# EAGLE schematic PPU_LITE_LATT_V3 (EAGLE 9.6.2)
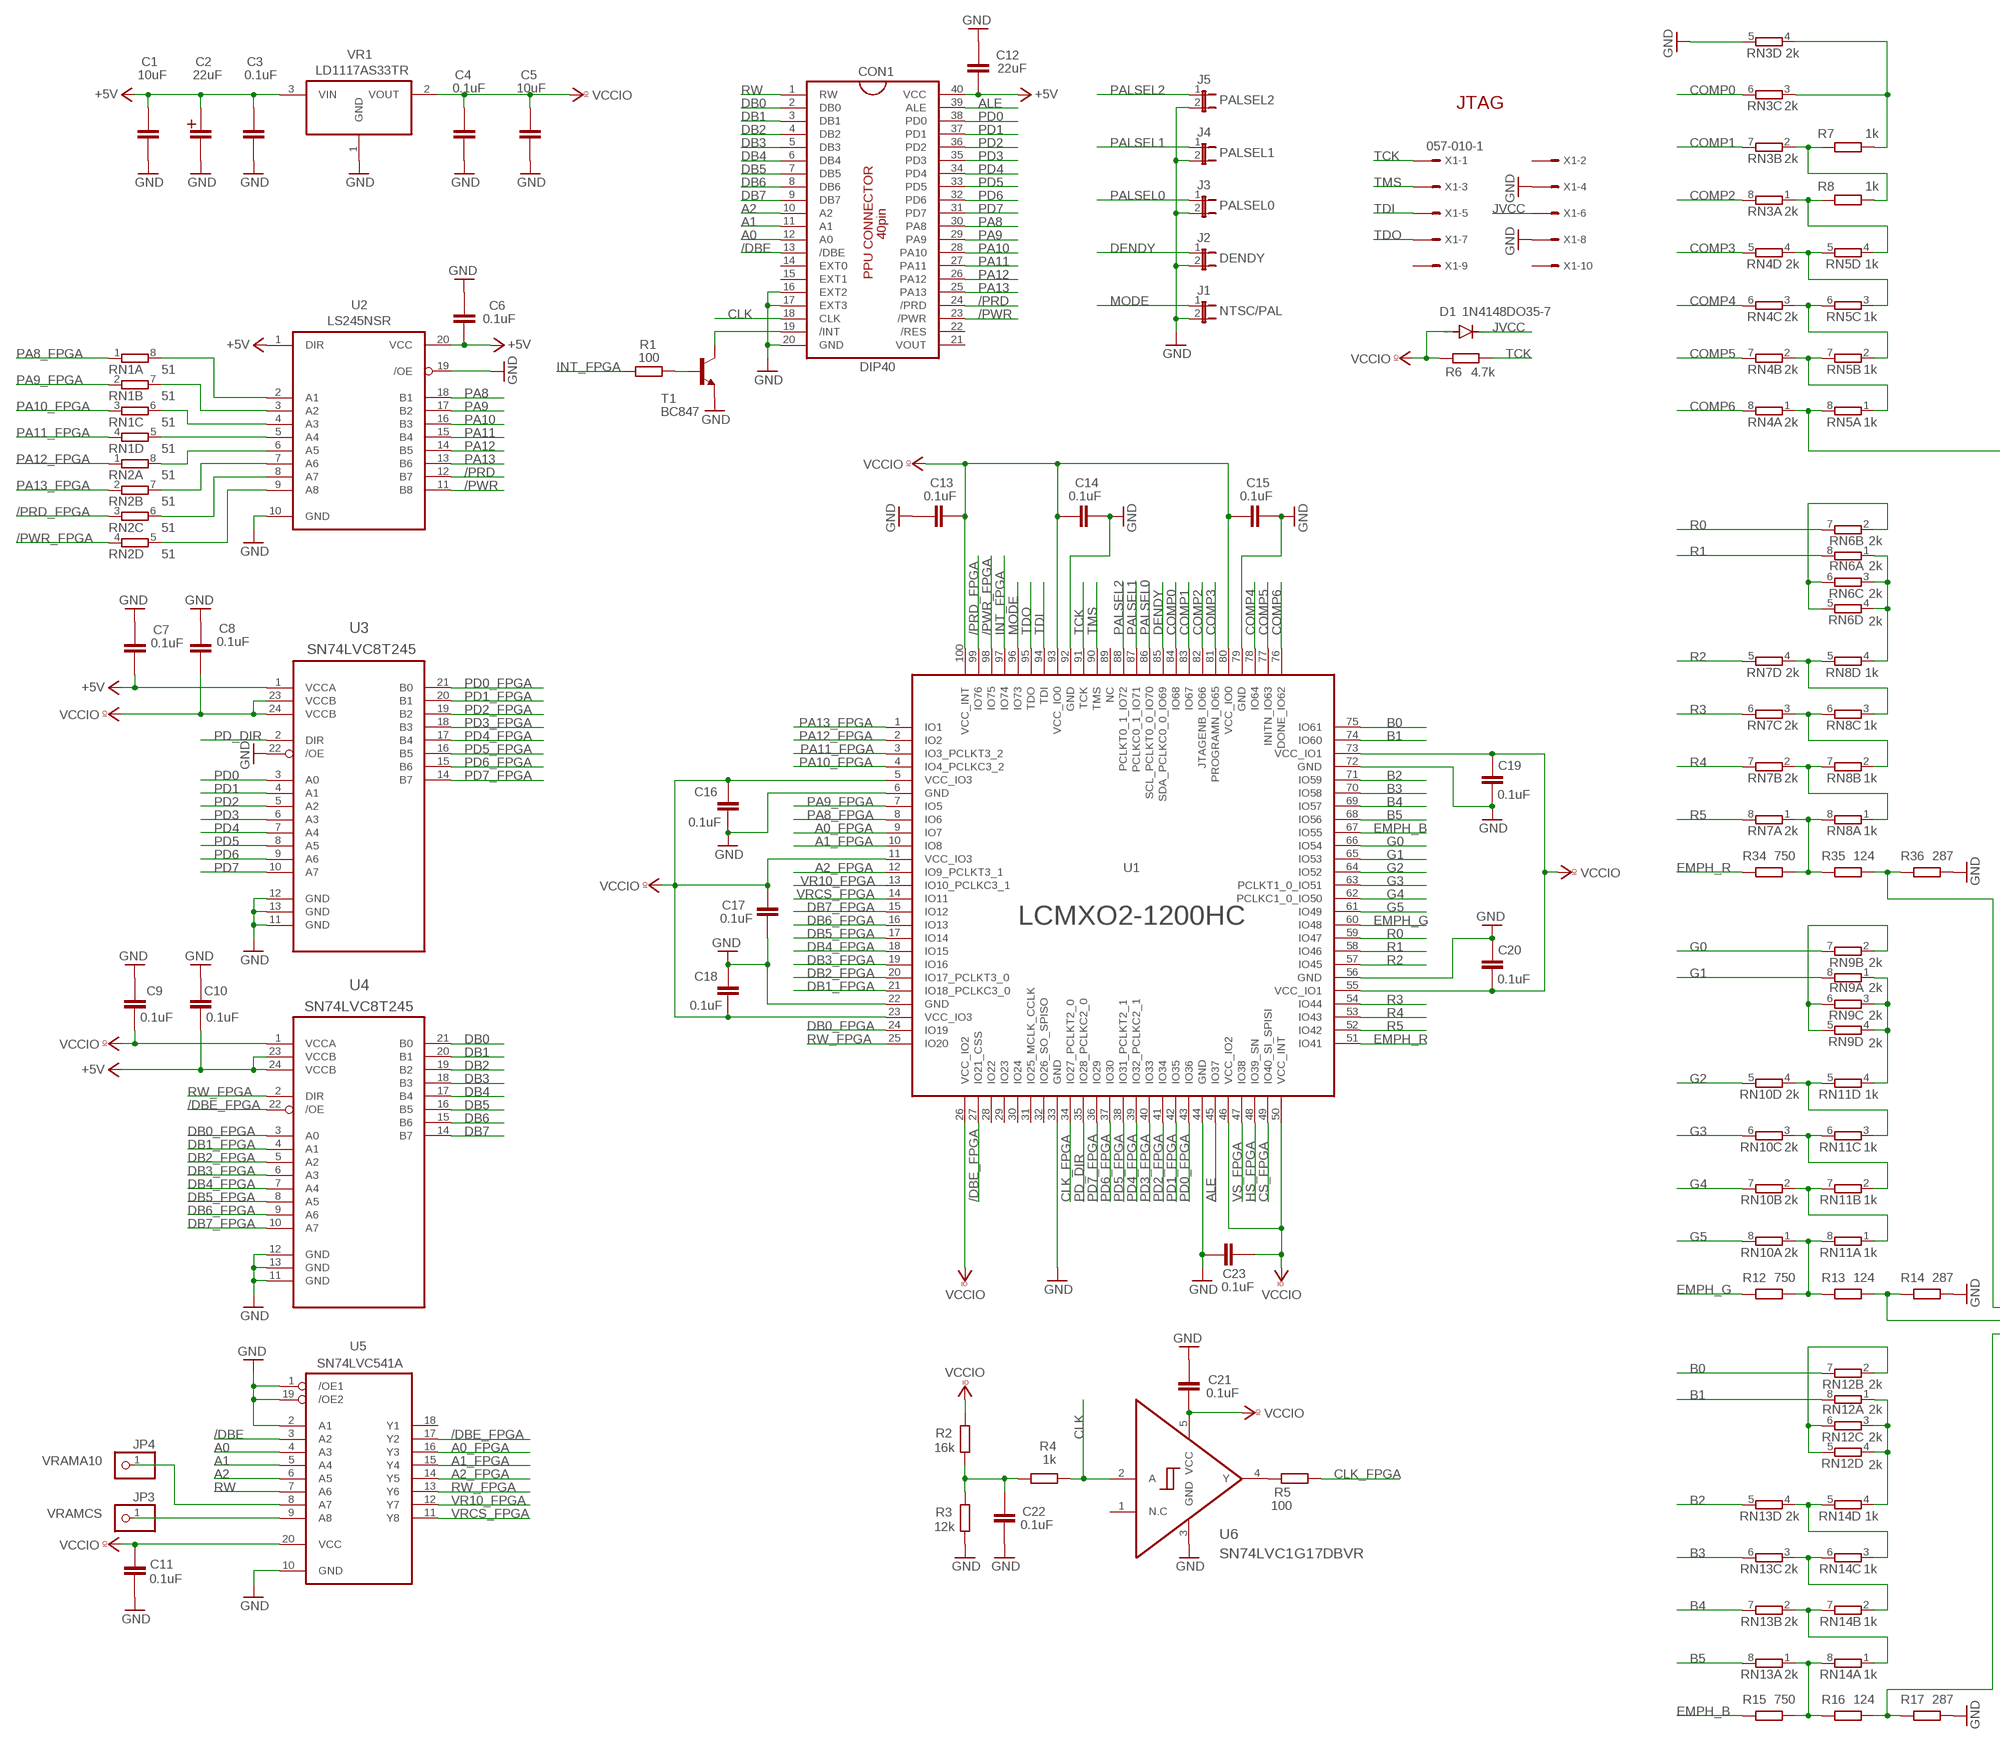
[diagram p0: schematic, sheet 1, part 1 of 2]
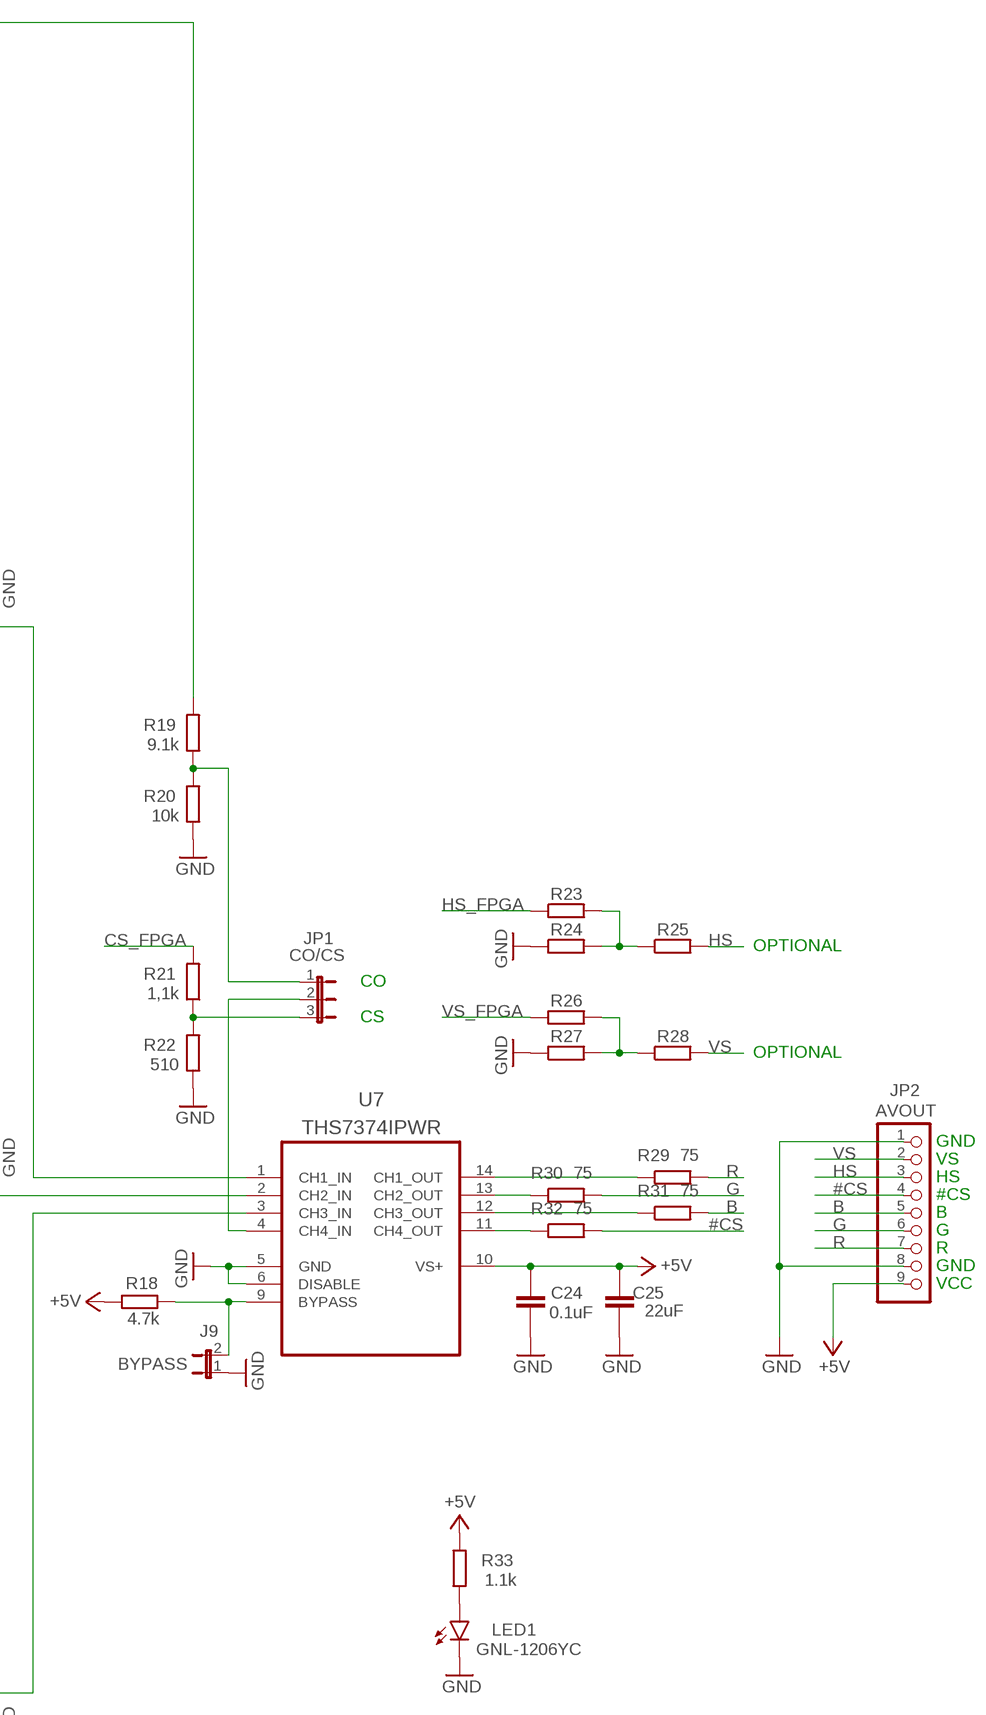
[diagram p1: schematic, sheet 1, part 2 of 2]

## Parts
C1  10uF  C-EUC0603  [C0603]
C2  22uF  CPOL-EU150CLZ-1014  [150CLZ-1014]
C3  0.1uF  C-EUC0603  [C0603]
C4  0.1uF  C-EUC0603  [C0603]
C5  10uF  C-EUC0603  [C0603]
C6  0.1uF  C-EUC0603  [C0603]
C7  0.1uF  C-EUC0603  [C0603]
C8  0.1uF  C-EUC0603  [C0603]
C9  0.1uF  C-EUC0603  [C0603]
C10  0.1uF  C-EUC0603  [C0603]
C11  0.1uF  C-EUC0603  [C0603]
C12  22uF  C-EUC0603  [C0603]
C13  0.1uF  C-EUC0603  [C0603]
C14  0.1uF  C-EUC0603  [C0603]
C15  0.1uF  C-EUC0603  [C0603]
C16  0.1uF  C-EUC0603  [C0603]
C17  0.1uF  C-EUC0603  [C0603]
C18  0.1uF  C-EUC0603  [C0603]
C19  0.1uF  C-EUC0603  [C0603]
C20  0.1uF  C-EUC0603  [C0603]
C21  0.1uF  C-EUC0603  [C0603]
C22  0.1uF  C-EUC0603  [C0603]
C23  0.1uF  C-EUC0603  [C0603]
C24  0.1uF  C-EUC0603  [C0603]
C25  22uF  C-EUC0603  [C0603]
CON1  DIP40  [DIP-40]
D1  1N4148DO35-7  [DO35-7]
J1  NTSC/PAL  JP1E  [JP1]
J2  DENDY  JP1E  [JP1]
J3  PALSEL0  JP1E  [JP1]
J4  PALSEL1  JP1E  [JP1]
J5  PALSEL2  JP1E  [JP1]
J9  BYPASS  JP1E  [JP1]
JP1  CO/CS  JP2W  [JP2W]
JP2  AVOUT  PINHD-1X9  [1X09]
JP3  VRAMCS  PINHD-1X1  [1X01]
JP4  VRAMA10  PINHD-1X1  [1X01]
LED1  GNL-1206YC  LEDSML1206  [SML1206]
R1  100  R-EU_R0805  [R0805]
R2  16k  R-EU_R0805  [R0805]
R3  12k  R-EU_R0805  [R0805]
R4  1k  R-EU_R0805  [R0805]
R5  100  R-EU_R0805  [R0805]
R6  4.7k  R-EU_R0805  [R0805]
R7  1k  R-EU_R0805  [R0805]
R8  1k  R-EU_R0805  [R0805]
R12  750  R-EU_R0805  [R0805]
R13  124  R-EU_R0805  [R0805]
R14  287  R-EU_R0805  [R0805]
R15  750  R-EU_R0805  [R0805]
R16  124  R-EU_R0805  [R0805]
R17  287  R-EU_R0805  [R0805]
R18  4.7k  R-EU_R0805  [R0805]
R19  9.1k  R-EU_R0805  [R0805]
R20  10k  R-EU_R0805  [R0805]
R21  1,1k  R-EU_R0805  [R0805]
R22  510  R-EU_R0805  [R0805]
R23  R-EU_R0805  [R0805]
R24  R-EU_R0805  [R0805]
R25  R-EU_R0805  [R0805]
R26  R-EU_R0805  [R0805]
R27  R-EU_R0805  [R0805]
R28  R-EU_R0805  [R0805]
R29  75  R-EU_R0805  [R0805]
R30  75  R-EU_R0805  [R0805]
R31  75  R-EU_R0805  [R0805]
R32  75  R-EU_R0805  [R0805]
R33  1.1k  R-EU_R0805  [R0805]
R34  750  R-EU_R0805  [R0805]
R35  124  R-EU_R0805  [R0805]
R36  287  R-EU_R0805  [R0805]
RN1  51  4R-N0603-ARC  [0603-ARC]
RN2  51  4R-N0603-ARC  [0603-ARC]
RN3  2k  4R-N0603-ARC  [0603-ARC]
RN4  2k  4R-N0603-ARC  [0603-ARC]
RN5  1k  4R-N0603-ARC  [0603-ARC]
RN6  2k  4R-N0603-ARC  [0603-ARC]
RN7  2k  4R-N0603-ARC  [0603-ARC]
RN8  1k  4R-N0603-ARC  [0603-ARC]
RN9  2k  4R-N0603-ARC  [0603-ARC]
RN10  2k  4R-N0603-ARC  [0603-ARC]
RN11  1k  4R-N0603-ARC  [0603-ARC]
RN12  2k  4R-N0603-ARC  [0603-ARC]
RN13  2k  4R-N0603-ARC  [0603-ARC]
RN14  1k  4R-N0603-ARC  [0603-ARC]
T1  BC847  [SOT23]
U1  LCMXO2-1200HC  [QFP50P1600X1600X120-100N]
U2  LS245NSR  [SO20]
U3  SN74LVC8T245  [SOP65P640X110-24N]
U4  SN74LVC8T245  [SOP65P640X110-24N]
U5  SN74LVC541A  [TSOP20]
U6  SN74LVC1G17DBVR  [SOT95P280X145-5N]
U7  THS7374IPWR  [SOP65P640X120-14N]
VR1  LD1117AS33TR  [SOT230P700X180-4N]
X1  057-010-1  [057-010-1]

## Nets
#CS: JP2.4 R32.2
+5V: C1.2 C2.+ C3.2 C6.1 C7.1 C10.1 C12.1 C24.2 C25.2 CON1.40(VCC) JP2.9 R18.1 R33.2 U2.1(DIR) U2.20(VCC) U3.1(VCCA) U4.23(VCCB) U4.24(VCCB) U7.10(VS+) VR1.3(VIN)
/DBE: CON1.13(/DBE) U5.3(A2)
/DBE_FPGA: U1.27(IO21_CSS) U4.22(/OE) U5.17(Y2)
/PRD: CON1.24(/PRD) U2.12(B7)
/PRD_FPGA: RN2.3 U1.99(IO76)
/PWR: CON1.23(/PWR) U2.11(B8)
/PWR_FPGA: RN2.4 U1.98(IO75)
A0: CON1.12(A0) U5.4(A3)
A0_FPGA: U1.9(IO7) U5.16(Y3)
A1: CON1.11(A1) U5.5(A4)
A1_FPGA: U1.10(IO8) U5.15(Y4)
A2: CON1.10(A2) U5.6(A5)
A2_FPGA: U1.12(IO9_PCLKT3_1) U5.14(Y5)
ALE: CON1.39(ALE) U1.45(IO37)
B: JP2.5 R31.2
B0: RN12.7 U1.75(IO61)
B1: RN12.8 U1.74(IO60)
B2: RN13.5 U1.71(IO59)
B3: RN13.6 U1.70(IO58)
B4: RN13.7 U1.69(IO57)
B5: RN13.8 U1.68(IO56)
CLK: CON1.18(CLK) R4.1 U6.2(A)
CLK_FPGA: R5.1 U1.34(IO27_PCLKT2_0)
COMP0: RN3.6 U1.84(IO68)
COMP1: RN3.7 U1.83(IO67)
COMP2: RN3.8 U1.82(JTAGENB_IO66)
COMP3: RN4.5 U1.81(PROGRAMN_IO65)
COMP4: RN4.6 U1.78(IO64)
COMP5: RN4.7 U1.77(INITN_IO63)
COMP6: RN4.8 U1.76(DONE_IO62)
CS_FPGA: R21.2 U1.49(IO40_SI_SPISI)
DB0: CON1.2(DB0) U4.21(B0)
DB0_FPGA: U1.24(IO19) U4.3(A0)
DB1: CON1.3(DB1) U4.20(B1)
DB1_FPGA: U1.21(IO18_PCLKC3_0) U4.4(A1)
DB2: CON1.4(DB2) U4.19(B2)
DB2_FPGA: U1.20(IO17_PCLKT3_0) U4.5(A2)
DB3: CON1.5(DB3) U4.18(B3)
DB3_FPGA: U1.19(IO16) U4.6(A3)
DB4: CON1.6(DB4) U4.17(B4)
DB4_FPGA: U1.18(IO15) U4.7(A4)
DB5: CON1.7(DB5) U4.16(B5)
DB5_FPGA: U1.17(IO14) U4.8(A5)
DB6: CON1.8(DB6) U4.15(B6)
DB6_FPGA: U1.16(IO13) U4.9(A6)
DB7: CON1.9(DB7) U4.14(B7)
DB7_FPGA: U1.15(IO12) U4.10(A7)
DENDY: J2.1 U1.85(SDA_PCLKC0_0_IO69)
EMPH_B: R15.1 U1.67(IO55)
EMPH_G: R12.1 U1.60(IO48)
EMPH_R: R34.1 U1.51(IO41)
G: JP2.6 R30.2
G0: RN9.7 U1.66(IO54)
G1: RN9.8 U1.65(IO53)
G2: RN10.5 U1.64(IO52)
G3: RN10.6 U1.63(PCLKT1_0_IO51)
G4: RN10.7 U1.62(PCLKC1_0_IO50)
G5: RN10.8 U1.61(IO49)
GND: C1.1 C2.- C3.1 C4.1 C5.1 C6.2 C7.2 C8.2 C9.2 C10.2 C11.1 C12.2 C13.2 C14.1 C15.1 C16.1 C17.1 C18.2 C19.1 C20.2 C21.2 C22.1 C23.2 C24.1 C25.1 CON1.16(EXT2) CON1.17(EXT3) CON1.20(GND) J1.2 J2.2 J3.2 J4.2 J5.2 J9.1 JP2.1 JP2.8 LED1.C R3.1 R14.2 R17.2 R20.1 R22.1 R24.1 R27.1 R36.2 RN3.5 T1.2(E) U1.6(GND) U1.22(GND) U1.33(GND) U1.44(GND) U1.56(GND) U1.72(GND) U1.79(GND) U1.92(GND) U2.10(GND) U2.19(/OE) U3.11(GND) U3.12(GND) U3.13(GND) U3.22(/OE) U4.11(GND) U4.12(GND) U4.13(GND) U5.1(/OE1) U5.2(A1) U5.10(GND) U5.19(/OE2) U6.3(GND) U7.5(GND) U7.6(DISABLE) VR1.1(GND) X1.4 X1.8
HS: JP2.3 R25.2
HS_FPGA: R23.1 U1.48(IO39_SN)
INT_FPGA: R1.1 U1.97(IO74)
JVCC: D1.C X1.6
MODE: J1.1 U1.96(IO73)
N$1: LED1.A R33.1
N$2: R5.2 U6.4(Y)
N$3: JP4.1 U5.8(A7)
N$4: CON1.19(/INT) T1.3(C)
N$5: R1.2 T1.1(B)
N$6: RN4.4 RN5.3 RN5.5
N$7: R8.1 RN3.1 RN5.4
N$8: RN4.3 RN5.2 RN5.6
N$9: RN4.2 RN5.1 RN5.7
N$10: RN2.5 U2.9(A8)
N$11: RN2.6 U2.8(A7)
N$12: RN2.7 U2.7(A6)
N$13: RN2.8 U2.6(A5)
N$14: JP1.2 U7.4(CH4_IN)
N$15: J9.2 R18.2 U7.9(BYPASS)
N$16: RN1.5 U2.5(A4)
N$18: RN1.6 U2.4(A3)
N$19: RN1.7 U2.3(A2)
N$20: RN1.8 U2.2(A1)
N$21: RN13.4 RN14.3 RN14.5
N$22: RN13.3 RN14.2 RN14.6
N$23: RN13.2 RN14.1 RN14.7
N$24: R23.2 R24.2 R25.1
N$25: JP1.1 R19.1 R20.2
N$26: R7.2 RN3.3 RN3.4
N$27: RN12.2 RN12.5 RN12.6
N$28: R7.1 R8.2 RN3.2
N$29: R15.2 R16.1 RN13.1 RN14.8
N$30: R16.2 R17.1 U7.3(CH3_IN)
N$31: RN12.1 RN12.3 RN12.4 RN14.4
N$34: R19.2 RN4.1 RN5.8
N$35: R26.2 R27.2 R28.1
N$38: R12.2 R13.1 RN10.1 RN11.8
N$39: JP3.1 U5.9(A8)
N$40: C22.2 R2.1 R3.2 R4.2
N$41: RN6.2 RN6.5 RN6.6
N$42: JP1.3 R21.1 R22.2
N$43: RN7.4 RN8.3 RN8.5
N$44: R13.2 R14.1 U7.2(CH2_IN)
N$45: RN6.1 RN6.3 RN6.4 RN8.4
N$46: RN10.4 RN11.3 RN11.5
N$47: RN10.3 RN11.2 RN11.6
N$48: RN10.2 RN11.1 RN11.7
N$50: RN9.2 RN9.5 RN9.6
N$51: RN9.1 RN9.3 RN9.4 RN11.4
N$53: RN7.3 RN8.2 RN8.6
N$54: RN7.2 RN8.1 RN8.7
N$55: R34.2 R35.1 RN7.1 RN8.8
N$56: R35.2 R36.1 U7.1(CH1_IN)
N$64: R29.1 U7.14(CH1_OUT)
N$65: R30.1 U7.13(CH2_OUT)
N$66: R31.1 U7.12(CH3_OUT)
N$67: R32.1 U7.11(CH4_OUT)
PA8: CON1.30(PA8) U2.18(B1)
PA8_FPGA: RN1.1 U1.8(IO6)
PA9: CON1.29(PA9) U2.17(B2)
PA9_FPGA: RN1.2 U1.7(IO5)
PA10: CON1.28(PA10) U2.16(B3)
PA10_FPGA: RN1.3 U1.4(IO4_PCLKC3_2)
PA11: CON1.27(PA11) U2.15(B4)
PA11_FPGA: RN1.4 U1.3(IO3_PCLKT3_2)
PA12: CON1.26(PA12) U2.14(B5)
PA12_FPGA: RN2.1 U1.2(IO2)
PA13: CON1.25(PA13) U2.13(B6)
PA13_FPGA: RN2.2 U1.1(IO1)
PALSEL0: J3.1 U1.86(SCL_PCLKT0_0_IO70)
PALSEL1: J4.1 U1.87(PCLKC0_1_IO71)
PALSEL2: J5.1 U1.88(PCLKT0_1_IO72)
PD0: CON1.38(PD0) U3.3(A0)
PD0_FPGA: U1.43(IO36) U3.21(B0)
PD1: CON1.37(PD1) U3.4(A1)
PD1_FPGA: U1.42(IO35) U3.20(B1)
PD2: CON1.36(PD2) U3.5(A2)
PD2_FPGA: U1.41(IO34) U3.19(B2)
PD3: CON1.35(PD3) U3.6(A3)
PD3_FPGA: U1.40(IO33) U3.18(B3)
PD4: CON1.34(PD4) U3.7(A4)
PD4_FPGA: U1.39(IO32_PCLKC2_1) U3.17(B4)
PD5: CON1.33(PD5) U3.8(A5)
PD5_FPGA: U1.38(IO31_PCLKT2_1) U3.16(B5)
PD6: CON1.32(PD6) U3.9(A6)
PD6_FPGA: U1.37(IO30) U3.15(B6)
PD7: CON1.31(PD7) U3.10(A7)
PD7_FPGA: U1.36(IO29) U3.14(B7)
PD_DIR: U1.35(IO28_PCLKC2_0) U3.2(DIR)
R: JP2.7 R29.2
R0: RN6.7 U1.59(IO47)
R1: RN6.8 U1.58(IO46)
R2: RN7.5 U1.57(IO45)
R3: RN7.6 U1.54(IO44)
R4: RN7.7 U1.53(IO43)
R5: RN7.8 U1.52(IO42)
RW: CON1.1(RW) U5.7(A6)
RW_FPGA: U1.25(IO20) U4.2(DIR) U5.13(Y6)
TCK: R6.1 U1.91(TCK) X1.1
TDI: U1.94(TDI) X1.5
TDO: U1.95(TDO) X1.7
TMS: U1.90(TMS) X1.3
VCCIO: C4.2 C5.2 C8.1 C9.1 C11.2 C13.1 C14.2 C15.2 C16.2 C17.2 C18.1 C19.2 C20.1 C21.1 C23.1 D1.A R2.2 R6.2 U1.5(VCC_IO3) U1.11(VCC_IO3) U1.23(VCC_IO3) U1.26(VCC_IO2) U1.46(VCC_IO2) U1.50(VCC_INT) U1.55(VCC_IO1) U1.73(VCC_IO1) U1.80(VCC_IO0) U1.93(VCC_IO0) U1.100(VCC_INT) U3.23(VCCB) U3.24(VCCB) U4.1(VCCA) U5.20(VCC) U6.5(VCC) VR1.2(VOUT)
VR10_FPGA: U1.13(IO10_PCLKC3_1) U5.12(Y7)
VRCS_FPGA: U1.14(IO11) U5.11(Y8)
VS: JP2.2 R28.2
VS_FPGA: R26.1 U1.47(IO38)
Unconnected: CON1.14(EXT0) CON1.15(EXT1) CON1.21(VOUT) CON1.22(/RES) U1.28(IO22) U1.29(IO23) U1.30(IO24) U1.31(IO25_MCLK_CCLK) U1.32(IO26_SO_SPISO) U1.89(NC) U5.18(Y1) U6.1(N.C) X1.2 X1.9 X1.10

## Notes on the sheet
- JTAG
- OPTIONAL
- CO
- CS
- OPTIONAL
- GND
- VS
- HS
- #CS
- B
- G
- R
- GND
- VCC

## Library data of the parts
C1 C3-C25 = rcl_my:C-EU: CAPACITOR, European symbol; SPICEPREFIX: C
C2 = rcl_my:CPOL-EU: POLARIZED CAPACITOR, European symbol; SPICEPREFIX: C
CON1 = SnapEDA-Library:DIP40
D1 = diode:1N4148: DIODE high speed (Philips)
J1-J5 J9 = jumper:JP1E: JUMPER
JP1 = jumper:JP2W: JUMPER
JP2 = pinhead:PINHD-1X9: PIN HEADER
JP3 JP4 = pinhead:PINHD-1X1: PIN HEADER
LED1 = led:LED: LED OSRAM: - CHIPLED LG R971, LG N971, LY N971, LG Q971, LY Q971, LO R971, LY R971 LH N974, LH R974 LS Q976, LO Q976, LY Q976 LO Q996 - Hyper CHIPLED LW Q18S LB Q993, LB Q99A, LB R99A - SideLED LS A670, LO A670, LY A670, LG A670, LP A670 LB A673, LV A673, LT A673, LW A673 LH A674 LY A675 LS A676, LA A676, LO A676, LY A676, LW A676 LS A679, LY A679, LG A679 - Hyper Micro SIDELED® LS Y876, LA Y876, LO Y876, LY Y876 LT Y87S - SmartLED LW L88C, LW L88S LB L89C, LB L89S, LG L890 LS L89K, LO L89K, LY L89K LS L896, LA L896, LO L896, LY L896 - TOPLED LS T670, LO T670, LY T670, LG T670, LP T670 LSG T670, LSP T670, LSY T670, LOP T670, LYG T670 LG T671, LOG T671, LSG T671 LB T673, LV T673, LT T673, LW T673 LH T674 LS T676, LA T676, LO T676, LY T676, LB T676, LH T676, LSB T676, LW T676 LB T67C, LV T67C, LT T67C, LS T67K, LO T67K, LY T67K, LW E67C LS E67B, LA E67B, LO E67B, LY E67B, LB E67C, LV E67C, LT E67C LW T67C LS T679, LY T679, LG T679 LS T770, LO T770, LY T770, LG T770, LP T770 LB T773, LV T773, LT T773, LW T773 LH T774 LS E675, LA E675, LY E675, LS T675 LS T776, LA T776, LO T776, LY T776, LB T776 LHGB T686 LT T68C, LB T68C - Hyper Mini TOPLED® LB M676 - Mini TOPLED Santana® LG M470 LS M47K, LO M47K, LY M47K Source: http://www.osram.convergy.de LUXEON: - LUMILED® LXK2-PW12-R00, LXK2-PW12-S00, LXK2-PW14-U00, LXK2-PW14-V00 LXK2-PM12-R00, LXK2-PM12-S00, LXK2-PM14-U00 LXK2-PE12-Q00, LXK2-PE12-R00, LXK2-PE12-S00, LXK2-PE14-T00, LXK2-PE14-U00 LXK2-PB12-K00, LXK2-PB12-L00, LXK2-PB12-M00, LXK2-PB14-N00, LXK2-PB14-P00, LXK2-PB14-Q00 LXK2-PR12-L00, LXK2-PR12-M00, LXK2-PR14-Q00, LXK2-PR14-R00 LXK2-PD12-Q00, LXK2-PD12-R00, LXK2-PD12-S00 LXK2-PH12-R00, LXK2-PH12-S00 LXK2-PL12-P00, LXK2-PL12-Q00, LXK2-PL12-R00 Source: www.luxeon.com KINGBRIGHT: KA-3528ASYC Source: www.kingbright.com
R1-R8 R12-R36 = rcl:R-EU_: RESISTOR, European symbol; SPICEPREFIX: R
RN1-RN14 = resistor-dil:4R-N: Array Chip Resistor Source: RS Component / Phycomp; OC_FARNELL: unknown; OC_NEWARK: unknown
T1 = transistor:BC847: NPN TRANSISTOR
U1 = LCMXO2-1200HC:LCMXO2-1200HC
U2 = LS245NSR:LS245NSR
U3 U4 = SnapEDA-Library:SN74LVC8T245
U5 = SnapEDA-Library:SN74LVC541A; PACKAGE: TSSOP-20; SUPPLIER: TI
U6 = SN74LVC1G17DBVR:SN74LVC1G17DBVR
U7 = THS7374IPWR:THS7374IPWR
VR1 = LD1117AS33TR:LD1117AS33TR
X1 = con-panduit:057-010-: CONNECTOR 10-pin series 057 contact pc board low profile headers; OC_FARNELL: unknown; OC_NEWARK: unknown